# Altium schematic sheet Connect_Interface.SchDoc
size A4
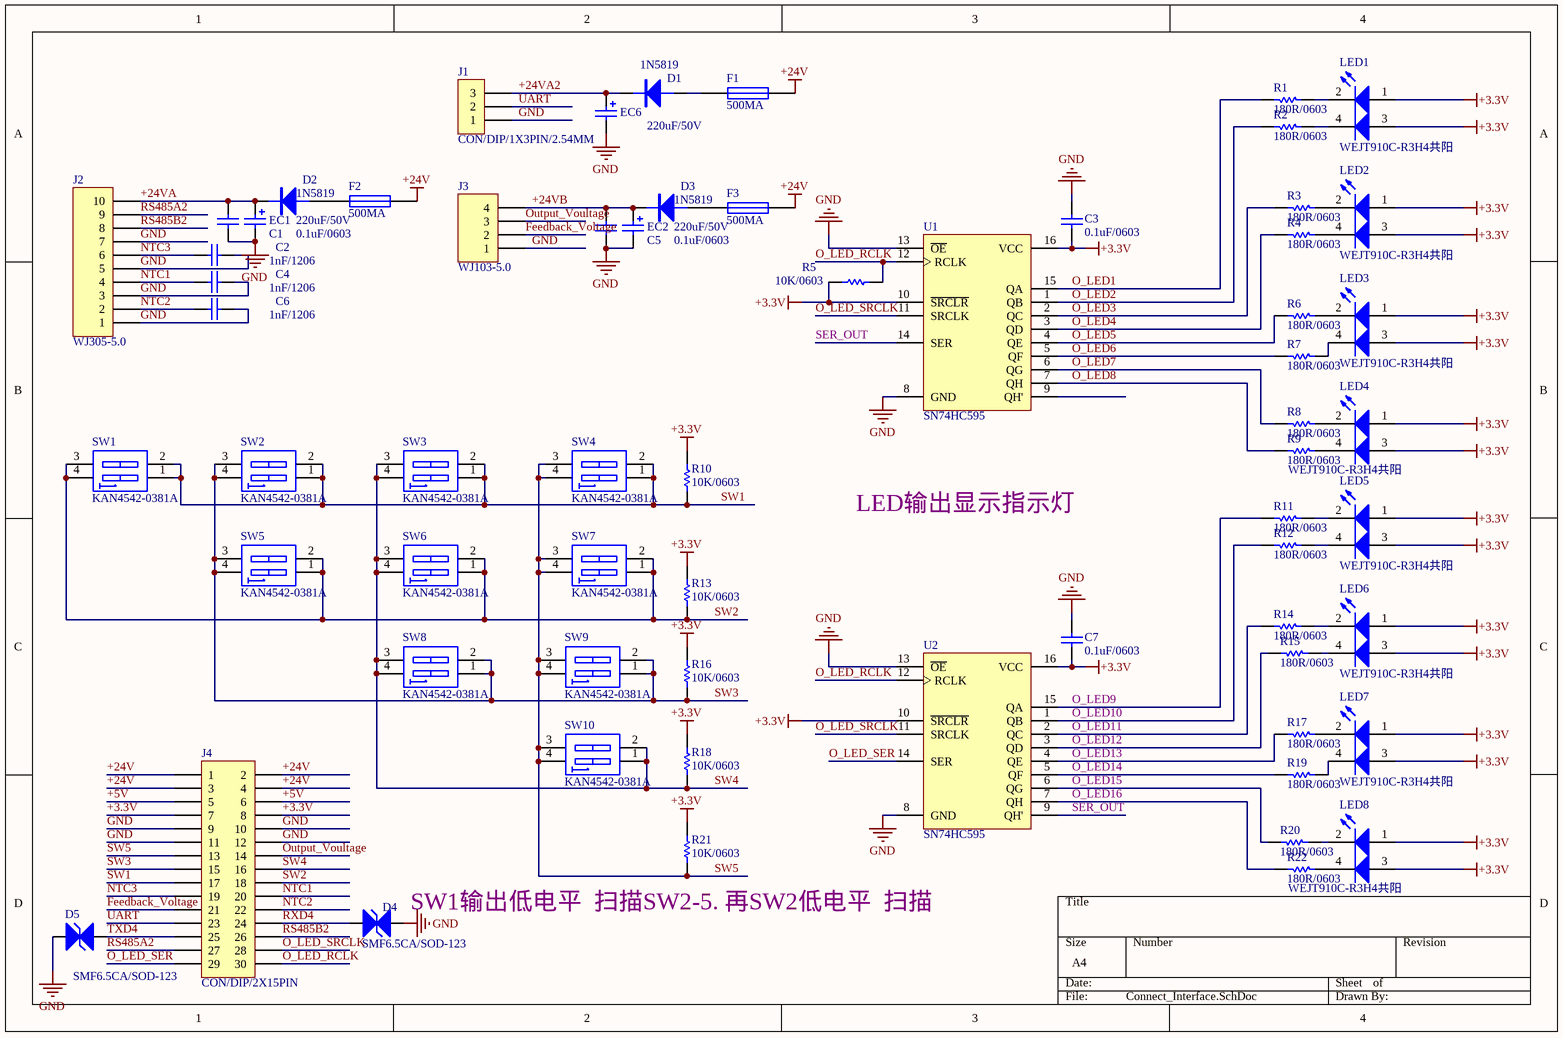
[diagram p0: Connect_Interface.SchDoc]

## Parts
C1  0.1uF/0603  [CAP/SMT/0603C]
C2  1nF/1206  [CAP/SMT/1206C]
C3  0.1uF/0603  [CAP/SMT/0603C]
C4  1nF/1206  [CAP/SMT/1206C]
C5  0.1uF/0603  [CAP/SMT/0603C]
C6  1nF/1206  [CAP/SMT/1206C]
C7  0.1uF/0603  [CAP/SMT/0603C]
D1  1N5819  [D/SMT/DO-214AC]
D2  1N5819  [D/SMT/DO-214AC]
D3  1N5819  [D/SMT/DO-214AC]
D4  SMF6.5CA/SOD-123  [D/SMT/SOD123]
D5  SMF6.5CA/SOD-123  [D/SMT/SOD123]
EC1  220uF/50V  [CAP/SMT/220UF/50V]
EC2  220uF/50V  [CAP/SMT/220UF/50V]
EC6  220uF/50V  [CAP/SMT/220UF/50V]
F1  500MA  [FUSE/100MA/SMC]
F2  500MA  [FUSE/100MA/SMC]
F3  500MA  [FUSE/100MA/SMC]
J1  CON/DIP/1X3PIN/2.54MM  [CON/DIP/1×3PIN/2.54MM/插件端子]
J2  WJ305-5.0  [CON/DIP/1×10PIN/5.0MM/WJ103-10P]
J3  WJ103-5.0  [CON/DIP/1×4PIN/5.0MM/WJ103-4P]
J4  CON/DIP/2X15PIN  [CON/DIP/2X15PIN/2.54MM]
LED1  WEJT910C-R3H4共阳  [D/SMT/WEJT910C-R3H4]
LED2  WEJT910C-R3H4共阳  [D/SMT/WEJT910C-R3H4]
LED3  WEJT910C-R3H4共阳  [D/SMT/WEJT910C-R3H4]
LED4  WEJT910C-R3H4共阳  [D/SMT/WEJT910C-R3H4]
LED5  WEJT910C-R3H4共阳  [D/SMT/WEJT910C-R3H4]
LED6  WEJT910C-R3H4共阳  [D/SMT/WEJT910C-R3H4]
LED7  WEJT910C-R3H4共阳  [D/SMT/WEJT910C-R3H4]
LED8  WEJT910C-R3H4共阳  [D/SMT/WEJT910C-R3H4]
R1  180R/0603  [0603R]
R2  180R/0603  [0603R]
R3  180R/0603  [0603R]
R4  180R/0603  [0603R]
R5  10K/0603  [0603R]
R6  180R/0603  [0603R]
R7  180R/0603  [0603R]
R8  180R/0603  [0603R]
R9  180R/0603  [0603R]
R10  10K/0603  [0603R]
R11  180R/0603  [0603R]
R12  180R/0603  [0603R]
R13  10K/0603  [0603R]
R14  180R/0603  [0603R]
R15  180R/0603  [0603R]
R16  10K/0603  [0603R]
R17  180R/0603  [0603R]
R18  10K/0603  [0603R]
R19  180R/0603  [0603R]
R20  180R/0603  [0603R]
R21  10K/0603  [0603R]
R22  180R/0603  [0603R]
SW1  KAN4542-0381A  [SWITCH/KAN4542]
SW2  KAN4542-0381A  [SWITCH/KAN4542]
SW3  KAN4542-0381A  [SWITCH/KAN4542]
SW4  KAN4542-0381A  [SWITCH/KAN4542]
SW5  KAN4542-0381A  [SWITCH/KAN4542]
SW6  KAN4542-0381A  [SWITCH/KAN4542]
SW7  KAN4542-0381A  [SWITCH/KAN4542]
SW8  KAN4542-0381A  [SWITCH/KAN4542]
SW9  KAN4542-0381A  [SWITCH/KAN4542]
SW10  KAN4542-0381A  [SWITCH/KAN4542]
U1  SN74HC595  [SOP-16]
U2  SN74HC595  [SOP-16]

## Nets
+3.3V: C3.1 C7.1 J4.7 J4.8 LED1.1(A) LED1.3(A) LED2.1(A) LED2.3(A) LED3.1(A) LED3.3(A) LED4.1(A) LED4.3(A) LED5.1(A) LED5.3(A) LED6.1(A) LED6.3(A) LED7.1(A) LED7.3(A) LED8.1(A) LED8.3(A) R5.1 R10.2 R13.2 R16.2 R18.2 R21.2 U1.10(~{SRCLR}) U1.16(VCC) U2.10(~{SRCLR}) U2.16(VCC)
+24V: F1.1 F2.2 F3.2 J4.1 J4.2 J4.3 J4.4
GND: C1.1 C2.2 C3.2 C4.2 C5.1 C6.2 C7.2 D4.2(K) D5.2(K) EC1.2 EC2.2 EC6.2 J1.1 J2.1 J2.3 J2.5 J2.7 J3.1 J4.9 J4.10 J4.11 J4.12 U1.8(GND) U1.13(~{OE}) U2.8(GND) U2.13(~{OE})
+5V: J4.5 J4.6
+24VA: C1.2 D2.1(K) EC1.1 J2.10
+24VA2: D1.1(K) EC6.1 J1.3
+24VB: C5.2 D3.1(K) EC2.1 J3.4
Feedback_Voltage: J3.2 J4.21
NTC1: C4.1 J2.4 J4.20
NTC2: C6.1 J2.2 J4.22
NTC3: C2.1 J2.6 J4.19
O_LED1: R1.1 U1.15(QA)
O_LED2: R2.1 U1.1(QB)
O_LED3: R3.1 U1.2(QC)
O_LED4: R4.1 U1.3(QD)
O_LED5: R6.1 U1.4(QE)
O_LED6: R7.1 U1.5(QF)
O_LED7: R8.1 U1.6(QG)
O_LED8: R9.1 U1.7(QH)
O_LED9: R11.1 U2.15(QA)
O_LED10: R12.1 U2.1(QB)
O_LED11: R14.1 U2.2(QC)
O_LED12: R15.1 U2.3(QD)
O_LED13: R17.1 U2.4(QE)
O_LED14: R19.1 U2.5(QF)
O_LED15: R20.1 U2.6(QG)
O_LED16: R22.1 U2.7(QH)
O_LED_RCLK: J4.30 R5.2 U1.12(RCLK) U2.12(RCLK)
O_LED_SER: J4.29 U2.14(SER)
O_LED_SRCLK: J4.28 U1.11(SRCLK) U2.11(SRCLK)
Output_Voultage: J3.3 J4.14
RS485A2: J2.9 J4.27
RS485B2: J2.8 J4.26
RXD4: D4.1(A) J4.24
SER_OUT: U1.14(SER) U2.9(QH')
SW1: J4.17 R10.1 SW1.1(A1) SW1.2(A2) SW2.1(A1) SW2.2(A2) SW3.1(A1) SW3.2(A2) SW4.1(A1) SW4.2(A2)
SW2: J4.18 R13.1 SW1.3(B2) SW1.4(B1) SW5.1(A1) SW5.2(A2) SW6.1(A1) SW6.2(A2) SW7.1(A1) SW7.2(A2)
SW3: J4.15 R16.1 SW2.3(B2) SW2.4(B1) SW5.3(B2) SW5.4(B1) SW8.1(A1) SW8.2(A2) SW9.1(A1) SW9.2(A2)
SW4: J4.16 R18.1 SW3.3(B2) SW3.4(B1) SW6.3(B2) SW6.4(B1) SW8.3(B2) SW8.4(B1) SW10.1(A1) SW10.2(A2)
SW5: J4.13 R21.1 SW4.3(B2) SW4.4(B1) SW7.3(B2) SW7.4(B1) SW9.3(B2) SW9.4(B1) SW10.3(B2) SW10.4(B1)
TXD4: D5.1(A) J4.25
UART: J1.2 J4.23
NetD1_2: D1.2(A) F1.2
NetD2_2: D2.2(A) F2.1
NetD3_2: D3.2(A) F3.1
NetLED1_2: LED1.2(K) R1.2
NetLED1_4: LED1.4(K) R2.2
NetLED2_2: LED2.2(K) R3.2
NetLED2_4: LED2.4(K) R4.2
NetLED3_2: LED3.2(K) R6.2
NetLED3_4: LED3.4(K) R7.2
NetLED4_2: LED4.2(K) R8.2
NetLED4_4: LED4.4(K) R9.2
NetLED5_2: LED5.2(K) R11.2
NetLED5_4: LED5.4(K) R12.2
NetLED6_2: LED6.2(K) R14.2
NetLED6_4: LED6.4(K) R15.2
NetLED7_2: LED7.2(K) R17.2
NetLED7_4: LED7.4(K) R19.2
NetLED8_2: LED8.2(K) R20.2
NetLED8_4: LED8.4(K) R22.2

Not connected (* = marked no-connect by the designer): U1 9(QH')

## Notes on the sheet
- Labels drawn without touching a wire or pin: LED输出显示指示灯, SW1输出低电平  扫描SW2-5. 再SW2低电平  扫描

## Library data of the parts
C1-C7 = CAP/CAP/SMT/0603C
D1 = D/D/SMT/1N4007/DO-214
D2 D3 = D/D/SMT/1N5819/DO-214
D4 D5 = D/TVS/SMT/SMF13CA/SOD-123
EC1 EC2 EC6 = CAP/AEC/DIP/330uF/25V
F1-F3 = FUSE/PTC/SMT/100MA
J1 = CON/DIP/1X3PIN/2.54MM: Connector
J2 = CON/DIP/1X10PIN/WJ305-5.0: Connector
J3 = CON/DIP/1X4PIN/WJ103-5.0MM: Connector
J4 = CON/DIP/2X15PIN: Connector; LatestRevisionDate: 17-Jul-2002; LatestRevisionNote: Re-released for DXP Platform.; Publisher: Altium Limited
LED1-LED8 = D/LED/DIP/WEJT910C-R3H4-BA共阳
R1-R22 = RES/RES/SMT/0603
SW1-SW10 = SWITCH/TACT/SMT/KAN4542-0381A: 4.5mm*4.5mm*3.8mm
U1 U2 = IC/TTL/SMT/SN74HC595: 8-bit serial-in,serial or parallel-out shift register with output latches;3-state